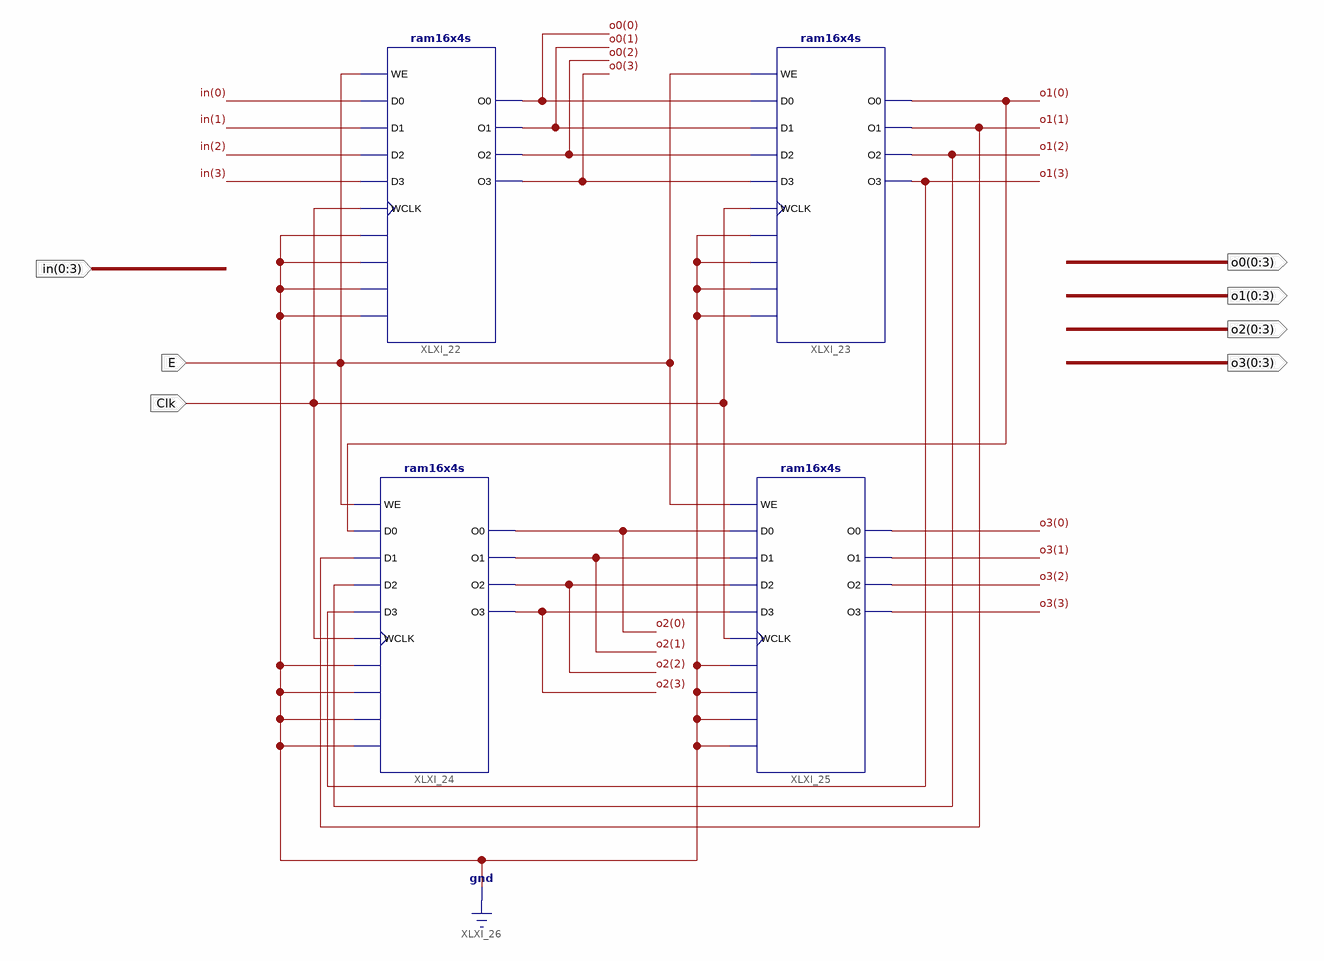
[diagram p0: schematic sheet 1]
// Xilinx ISE schematic MyRAM.sch (spartan6) as structural Verilog: 4 symbols, 7 ports
module MyRAM (
  input  Clk,
  input  E,
  input  [0:3] in,
  output [0:3] o0,
  output [0:3] o1,
  output [0:3] o2,
  output [0:3] o3
);

  ram16x4s XLXI_22 (
    .A0(1'b0), .A1(1'b0), .A2(1'b0), .A3(1'b0), .D0(in[0]), .D1(in[1]), .D2(in[2]), .D3(in[3]), .WCLK(Clk),
    .WE(E), .O0(o0[0]), .O1(o0[1]), .O2(o0[2]), .O3(o0[3]));
  ram16x4s XLXI_24 (
    .A0(1'b0), .A1(1'b0), .A2(1'b0), .A3(1'b0), .D0(o1[0]), .D1(o1[1]), .D2(o1[2]), .D3(o1[3]), .WCLK(Clk),
    .WE(E), .O0(o2[0]), .O1(o2[1]), .O2(o2[2]), .O3(o2[3]));
  ram16x4s XLXI_23 (
    .A0(1'b0), .A1(1'b0), .A2(1'b0), .A3(1'b0), .D0(o0[0]), .D1(o0[1]), .D2(o0[2]), .D3(o0[3]), .WCLK(Clk),
    .WE(E), .O0(o1[0]), .O1(o1[1]), .O2(o1[2]), .O3(o1[3]));
  ram16x4s XLXI_25 (
    .A0(1'b0), .A1(1'b0), .A2(1'b0), .A3(1'b0), .D0(o2[0]), .D1(o2[1]), .D2(o2[2]), .D3(o2[3]), .WCLK(Clk),
    .WE(E), .O0(o3[0]), .O1(o3[1]), .O2(o3[2]), .O3(o3[3]));
endmodule
